# EAGLE design charging_circuit (EAGLE 7.0.0)
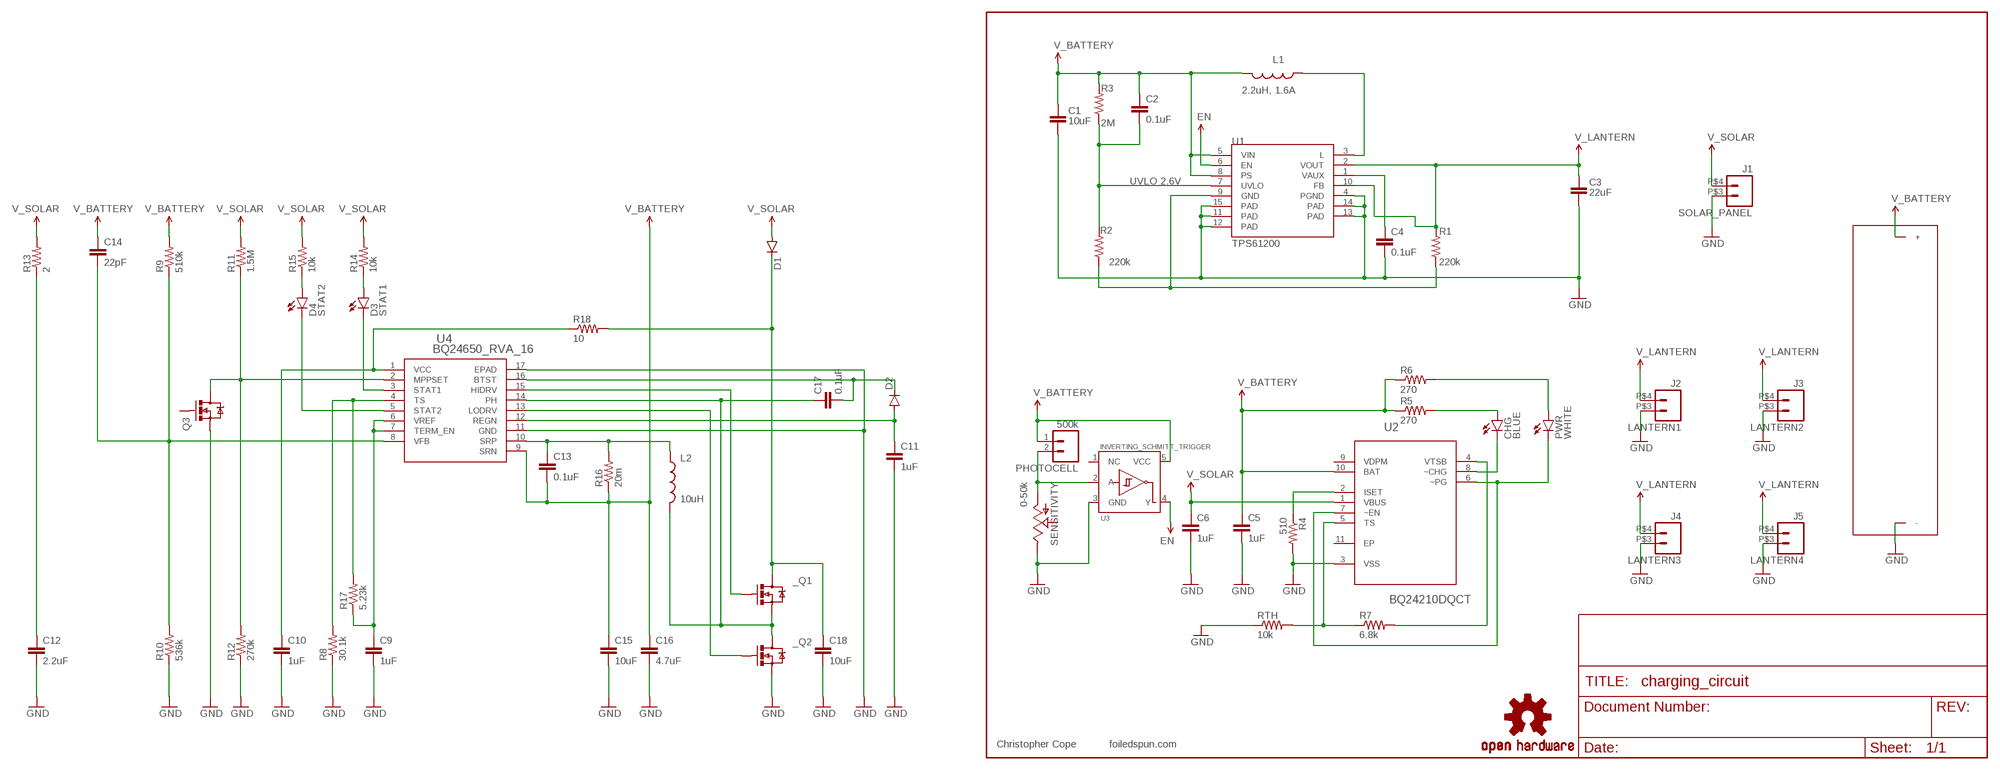
[diagram p0: schematic, sheet 1]

## Parts
_  MOSFET-DUAL_NCHANNEL  [POWERPAK_SO-8]
C1  10uF  CAP1206  [1206]
C2  0.1uF  CAP0402-CAP  [0402-CAP]
C3  22uF  CAP0805  [0805]
C4  0.1uF  CAP0402-CAP  [0402-CAP]
C5  1uF  1UF-25V-10%(0805)  [0805]
C6  1uF  1UF-25V-10%(0805)  [0805]
C9  1uF  CAP0402-CAP  [0402-CAP]
C10  1uF  CAP0402-CAP  [0402-CAP]
C11  1uF  CAP0402-CAP  [0402-CAP]
C12  2.2uF  CAP0402-CAP  [0402-CAP]
C13  0.1uF  CAP0805  [0805]
C14  22pF  CAP0603-CAP  [0603-CAP]
C15  10uF  CAP1210  [1210]
C16  4.7uF  CAP1210  [1210]
C17  0.1uF  CAP0805  [0805]
C18  10uF  CAP1210  [1210]
CHG  BLUE  LED0603  [LED-0603]
D1  DIODEPDS1040  [POWERDI-5]
D2  DIODESOT23  [SOT23-3]
D3  STAT1  LED-GREEN0603  [LED-0603]
D4  STAT2  LED-GREEN0603  [LED-0603]
L1  2.2uH, 1.6A  INDUCTOR1210  [1210]
L2  10uH  INDUCTORIHLP-2525CZ-01  [IHLP-2525CZ-01]
LANTERN1  J2  MICRO_MATE-N-LOCK  [2-1445100-2]
LANTERN2  J3  MICRO_MATE-N-LOCK  [2-1445100-2]
LANTERN3  J4  MICRO_MATE-N-LOCK  [2-1445100-2]
LANTERN4  J5  MICRO_MATE-N-LOCK  [2-1445100-2]
LOGO2  OSHW-LOGOL  [OSHW-LOGO-L]
PHOTOCELL  500k  M021X02_SMD  [1X02_SMD]
PWR  WHITE  LED0603  [LED-0603]
Q3  MOSFET-NCHANNEL  [SOT23-3]
R1  220k  RESISTOR0402-RES  [0402-RES]
R2  220k  RESISTOR0402-RES  [0402-RES]
R3  2M  RESISTOR0402-RES  [0402-RES]
R4  510  RESISTOR0402-RES  [0402-RES]
R5  270  RESISTOR0402-RES  [0402-RES]
R6  270  RESISTOR0402-RES  [0402-RES]
R7  6.8k  RESISTOR0402-RES  [0402-RES]
R8  30.1k  RESISTOR0402-RES  [0402-RES]
R9  510k  RESISTOR0402-RES  [0402-RES]
R10  536k  RESISTOR0402-RES  [0402-RES]
R11  1.5M  RESISTOR0402-RES  [0402-RES]
R12  270k  RESISTOR0402-RES  [0402-RES]
R13  2  RESISTOR0402-RES  [0402-RES]
R14  10k  RESISTOR0402-RES  [0402-RES]
R15  10k  RESISTOR0402-RES  [0402-RES]
R16  20m  RESISTOR1206  [1206]
R17  5.23k  RESISTOR0402-RES  [0402-RES]
R18  10  RESISTOR1206  [1206]
RTH  10k  RESISTOR0402-RES  [0402-RES]
SENSITIVITY  0-50k  POTTRIM_POT-SMD  [TRIM_POT-SMD]
SOLAR_PANEL  J1  MICRO_MATE-N-LOCK  [2-1445100-2]
U1  TPS61200  [QFN-10_PAD]
U2  BQ24210DQCT  [SON50P200X300X80-11N]
U3  INVERTING_SCHMITT_TRIGGER  [SC-70-5(DCK)]
U4  BQ24650_RVA_16  [RVA16_2P14X2P14]
U$1  18650-HOLDER  [18650]

## Nets
EN: U1.6(EN) U3.4(Y)
GND: _.P$3$S2(Q2:S) C1.2 C3.2 C4.2 C5.2 C6.2 C9.2 C10.2 C11.2 C12.2 C15.2 C16.2 C18.2 LANTERN1.P$3 LANTERN2.P$3 LANTERN3.P$3 LANTERN4.P$3 Q3.2(S) R4.2 R8.1 R10.1 R12.1 RTH.1 SENSITIVITY.P$3(E) SOLAR_PANEL.P$3 U1.4(PGND) U1.11(PAD) U1.12(PAD) U1.13(PAD) U1.14(PAD) U1.15(PAD) U2.3(VSS) U3.3(GND) U4.11(GND) U4.17(EPAD) U$1.-
GND1: R1.1 R2.1 U1.9(GND)
N$1: C4.1 U1.1(VAUX)
N$2: L1.1 U1.3(L)
N$3: CHG.C U2.8(~CHG)
N$4: PWR.C U2.6(~PG) U2.7(~EN)
N$5: CHG.A R5.2
N$6: PWR.A R6.2
N$7: PHOTOCELL.2 SENSITIVITY.P$1(A) U3.2(A)
N$8: R4.1 U2.2(ISET)
N$9: R7.2 U2.4(VTSB)
N$11: R7.1 RTH.2 U2.5(TS)
N$14: C10.1 R18.1 U4.1(VCC)
N$15: C14.2 R9.1 R10.2 U4.8(VFB)
N$18: C11.1 D2.1(A) U4.12(REGN)
N$19: Q3.3(D) R11.1 R12.2 U4.2(MPPSET)
N$22: C12.1 R13.1
N$23: D3.C U4.3(STAT1)
N$26: D4.C U4.5(STAT2)
N$27: D4.A R15.1
N$30: D3.A R14.1
N$31: R8.2 R17.2 U4.4(TS)
N$32: C17.2 D2.3(C) U4.16(BTST)
N$33: _.P$1$S1(Q1:S) _.P$5$D2(Q2:D) _.P$6$D2(Q2:D) _.P$D2(Q2:D) C17.1 L2.P$2 U4.14(PH)
N$34: C9.1 R17.1 U4.6(VREF) U4.7(TERM_EN)
N$35: _.P$4$G2(Q2:G) U4.13(LODRV)
N$36: _.P$2$G1(Q1:G) U4.15(HIDRV)
N$37: _.P$7$D1(Q1:D) _.P$8$D1(Q1:D) _.P$D1(Q1:D) C18.1 D1.P$3(C) R18.2
N$38: C13.1 L2.P$1 R16.2 U4.10(SRP)
UVLO: C2.2 R2.2 R3.1 U1.7(UVLO)
V_BATTERY: C1.1 C2.1 C5.1 C13.2 C14.1 C15.1 C16.1 L1.2 PHOTOCELL.1 R3.2 R5.1 R6.1 R9.2 R16.1 U1.5(VIN) U1.8(PS) U2.10(BAT) U3.5(VCC) U4.9(SRN) U$1.+
V_LANTERN: C3.1 LANTERN1.P$4 LANTERN2.P$4 LANTERN3.P$4 LANTERN4.P$4 R1.2 U1.2(VOUT) U1.10(FB)
V_SOLAR: C6.1 D1.P$1(A) D1.P$2(A) R11.2 R13.2 R14.2 R15.2 SOLAR_PANEL.P$4 U2.1(VBUS)
Unconnected: Q3.1(G) SENSITIVITY.P$2(S) U2.9(VDPM) U2.11(EP) U3.1(NC)

## Notes on the sheet
- UVLO 2.6V
- Christopher Cope | foiledspun.com

## Library data of the parts
_ = EAGLE_Libraries:MOSFET-DUAL_NCHANNEL
C1 C3 = CH_passive:CAP: Capacitor Standard 0603 ceramic capacitor, and 0.1" leaded capacitor.
C2 C4 C9-C12 = SparkFun:CAP: Capacitor Standard 0603 ceramic capacitor, and 0.1" leaded capacitor.
C5 C6 = SparkFun-Capacitors:1UF-25V-10%(0805): CAP-08064; PROD_ID: CAP-08064
C13-C18 = SparkFun-Passives:CAP: Capacitor Standard 0603 ceramic capacitor, and 0.1" leaded capacitor.
CHG PWR = SparkFun-LED:LED: LEDs Standard schematic elements and footprints for 5mm, 3mm, 1206, and 0603 sized LEDs. 5mm - Spark Fun Electronics SKU : COM-00529 (and others)
D1 = EAGLE_Libraries:DIODE: Diode These are standard reverse protection diodes and small signal diodes. SMA package can handle up to about 1A. SOD-323 can handle about 200mA. What the SOD-323 package when ordering, there are some mfgs out there that are 5-pin packages.
D2 = SparkFun-DiscreteSemi:DIODE: Diode These are standard reverse protection diodes and small signal diodes. SMA package can handle up to about 1A. SOD-323 can handle about 200mA. What the SOD-323 package when ordering, there are some mfgs out there that are 5-pin packages.
D3 D4 = SparkFun-LED:LED-GREEN: Various green LEDs Green LEDs used in SFE Production 0603- DIO-00821 LARGE- DIO-00862 LILYPAD- DIO-09910; PROD_ID: DIO-00821; VALUE: GREEN
L1 = CRC:INDUCTOR: Inductors
L2 = EAGLE_Libraries:INDUCTOR: Inductors
LANTERN1-LANTERN4 SOLAR_PANEL = CRC:MICRO_MATE-N-LOCK
LOGO2 = SparkFun-Aesthetics:OSHW-LOGO: Open Source Hardware Logo This logo indicates the piece of hardware it is found on incorporates a OSHW license and/or adheres to the definition of open source hardware found here: http://freedomdefined.org/OSHW
PHOTOCELL = CRC:M02: Header 2 Standard 2-pin 0.1" header. Use with straight break away headers (SKU : PRT-00116), right angle break away headers (PRT-00553), swiss pins (PRT-00743), machine pins (PRT-00117), and female headers (PRT-00115). Molex polarized connector foot print use with SKU : PRT-08233 with associated crimp pins and housings.
Q3 = EAGLE_Libraries:MOSFET-NCHANNEL: Generic NMOSFET 2N7002-7 - 2N7002-FDICT-ND <http://www.sparkfun.com/products/10349> (SOT-23-3 -60V ) (1.Gate 2.Source 3.Drain); PROD_ID: 2N7002-FDICT-ND
R1-R3 R9-R13 = SparkFun:RESISTOR: Resistor Basic schematic elements and footprints for 0603, 1206, and PTH resistors.
R4-R7 RTH = SparkFun-Resistors:RESISTOR: Resistor Basic schematic elements and footprints for 0603, 1206, and PTH resistors.
R8 R14-R18 = SparkFun-Passives:RESISTOR: Resistor Basic schematic elements and footprints for 0603, 1206, and PTH resistors.
SENSITIVITY = CRC:POT
U1 = SparkFun:TPS61200: DC to DC Booster
U2 = CRC:BQ24210DQCT: Single Cell Li-Ion Battery Solar Charger; MPN: BQ24210DQCT; OC_FARNELL: 1903633; OC_NEWARK: 56T0491; PACKAGE: SON-10; SUPPLIER: TEXAS INSTRUMENTS
U3 = CRC:INVERTING_SCHMITT_TRIGGER: Inverting Schmitt Trigger Used in External Clock Sources. Digikey P/N 296-11608-1-ND
U4 = CRC:BQ24650_RVA_16; DATASHEETURL: http://www.ti.com/lit/gpn/BQ24650; DESCRIPTION: High Efficiency Synchronous Switch-Mode Charger Controller  Solar Battery Charger; FAMILY_NAME: BATTERY CHARGE MANAGEMENT; GENERIC_PART_NUMBER: BQ24650; INDUSTRY_STD_PKG_TYPE: VQFN; MANUFACTURER: Texas Instruments; PACKAGE_DESIGNATOR: RVA; PIN_COUNT: 16
U$1 = CRC:18650-HOLDER

## Board
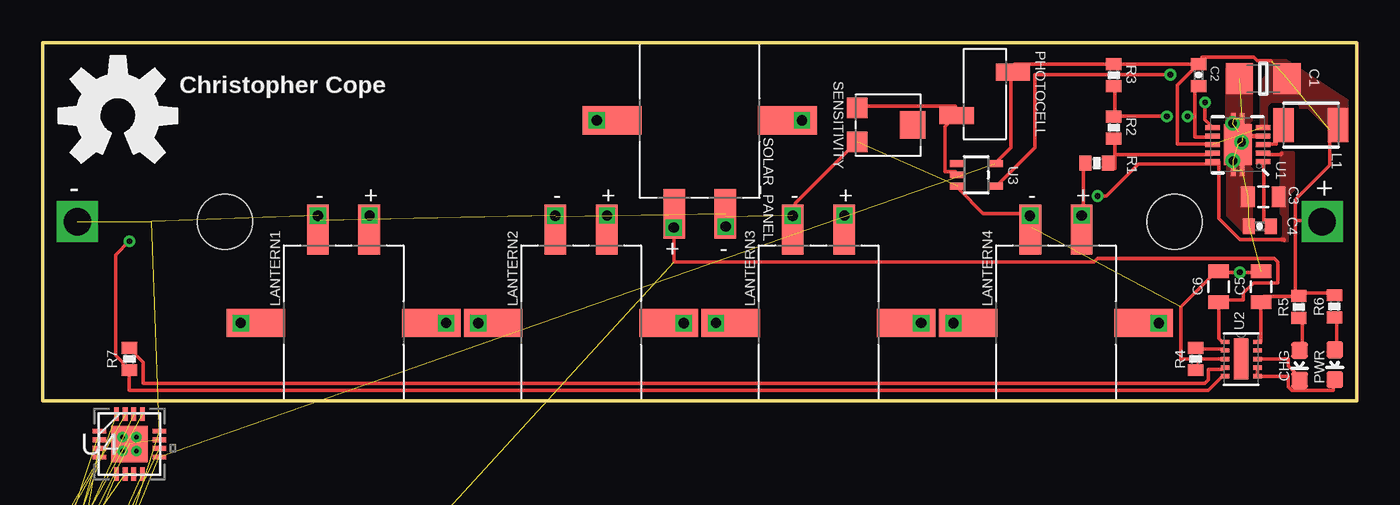
[diagram p1: board, top side]
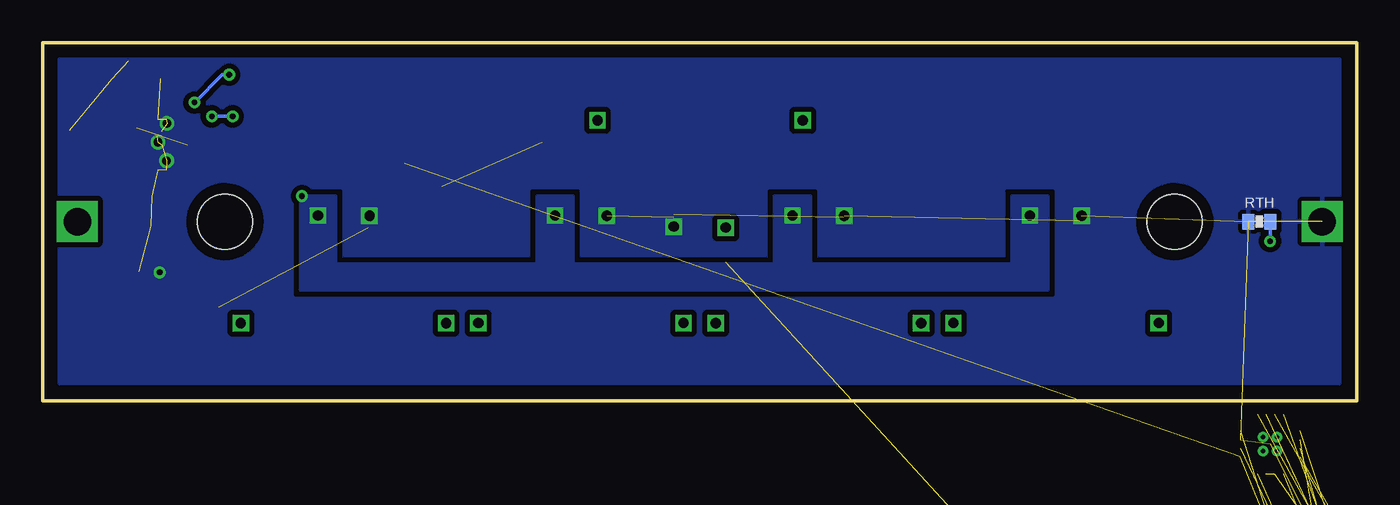
[diagram p2: board, bottom side, seen from below]

Size 76.96 x 20.98 mm. Coordinates in mm from the lower left corner, seen from the top.
Outline: 0,0 76.96,0 76.96,20.98 0,20.98 0,0
Copper layers (1*16): Top 0.0356mm / dielectric 1.5011mm / Bottom 0.0356mm
Design rules "LaenPCBOrder *": minimum track width 8mil, minimum drill 13mil, track to track 6mil, track to pad 6mil, pad to pad 6mil, via to via 6mil, smd to smd 6mil, copper to edge 15mil, drill to drill 6mil, minimum pad ring 7mil, minimum via ring 7mil, stop-mask expansion 4mil, vias tented up to drill 20mil, thermal gap 10mil

### Footprints (pad centres in the part's own frame; a part is rotated, then mirrored left to right if it is on the bottom)
POWERPAK_SO-8 = smd 1.27 x 0.61: P$1$S1 -2.667,1.905; P$2$G1 -2.667,0.635; P$3$S2 -2.667,-0.635; P$4$G2 -2.667,-1.905 | smd 1.016 x 0.61: P$5$D2 2.794,-1.905; P$6$D2 2.794,-0.635; P$7$D1 2.794,0.635; P$8$D1 2.794,1.905 | smd 3.81 x 1.651: P$D1 0.686,1.13; P$D2 0.686,-1.13
1206 = smd 1.6 x 1.8: 1 -1.4,0; 2 1.4,0
0402-CAP = smd 0.7 x 0.9: 1 -0.65,0; 2 0.65,0
0805 = smd 0.8 x 1.2: 1 -0.9,0; 2 0.9,0
0603-CAP = smd 1.1 x 1: 1 -0.85,0; 2 0.85,0
1210 = smd 1.2 x 2: 1 -1.6,0; 2 1.6,0
LED-0603 = smd 1 x 1: A 0,-0.877; C 0,0.877
POWERDI-5 = smd 1.39 x 1.4: P$1 -0.92,-2.856; P$2 0.92,-2.856 | smd 3.36 x 4.86: P$3 0,1.126
SOT23-3 = smd 0.8 x 0.9: 1 -0.95,-1; 2 0.95,-1; 3 0,1.1
IHLP-2525CZ-01 = smd 1.829 x 3.429: P$1 -2.769,0; P$2 2.769,0
2-1445100-2 = smd 3.43 x 1.65: P$1 5.135,0; P$2 -5.135,0 | smd 1.27 x 2.92: P$3 -1.5,5.48; P$4 1.5,5.48
1X02_SMD = smd 1 x 2: 1 1.27,-1.65; 2 -1.27,1.65
0402-RES = smd 0.7 x 0.9: 1 -0.65,0; 2 0.65,0
TRIM_POT-SMD = smd 1.2 x 1.2: P$1 -1,-1.8; P$3 1,-1.8 | smd 1.6 x 1.5: P$2 0,1.45
QFN-10_PAD = smd 0.297 x 0.85: 1 -1,-1.475; 2 -0.5,-1.475; 3 0,-1.475; 4 0.5,-1.475; 5 1,-1.475; 6 1,1.475; 7 0.5,1.475; 8 0,1.475; 9 -0.5,1.475; 10 -1,1.475 | smd 0.7 x 0.28: 11 -1.5,0.25; 12 -1.5,-0.25; 13 1.5,0.25; 14 1.5,-0.25 | smd 2.4 x 1.65: 15 0,0
SON50P200X300X80-11N = smd 0.5 x 0.25: 1 -0.95,1; 2 -0.95,0.5; 3 -0.95,0; 4 -0.95,-0.5; 5 -0.95,-1; 6 0.95,-1; 7 0.95,-0.5; 8 0.95,0; 9 0.95,0.5; 10 0.95,1 | smd 0.84 x 2.4: 11 0,0
SC-70-5(DCK) = smd 0.4 x 0.9: 1 -0.65,-1.1; 2 0,-1.1; 3 0.65,-1.1; 4 0.65,1.1; 5 -0.65,1.1
RVA16_2P14X2P14 = smd 0.787 x 0.279: 1 -1.753,0.762; 2 -1.753,0.254; 3 -1.753,-0.254; 4 -1.753,-0.762; 9 1.753,-0.762; 10 1.753,-0.254; 11 1.753,0.254; 12 1.753,0.762 | smd 0.279 x 0.787: 5 -0.762,-1.753; 6 -0.254,-1.753; 7 0.254,-1.753; 8 0.762,-1.753; 13 0.762,1.753; 14 0.254,1.753; 15 -0.254,1.753; 16 -0.762,1.753 | smd 2.134 x 2.134: 17 0,0 | drill 0.254: V 0.406,0.406; V_2 -0.406,0.406; V_3 -0.406,-0.406; V_4 0.406,-0.406
18650 = drill 1.6 square: + 36.45,0; - -36.45,0 | hole 3.2: -27.81,0; 27.81,0

### Placement (x,y rotation side)
_  -25.4,-60.2 0 top  (outside the outline)
C1  71.48,18.86 180 top
C2  67.69,19.07 270 top
C3  71.48,11.96 180 top
C4  71.28,10.23 180 top
C5  71.35,6.68 90 top
C6  68.88,6.68 90 top
C9  -1.27,-13.97 0 top  (outside the outline)
C10  -1.27,-17.78 0 top  (outside the outline)
C11  -1.27,-29.21 0 top  (outside the outline)
C12  -1.27,-44.45 0 top  (outside the outline)
C13  -14.3,-49.4 0 top  (outside the outline)
C14  -14.3,-52.7 0 top  (outside the outline)
C15  -13.5,-59.6 0 top  (outside the outline)
C16  -13.5,-62.5 0 top  (outside the outline)
C17  -20.4,-61.9 0 top  (outside the outline)
C18  -26.5,-65.4 0 top  (outside the outline)
CHG  73.61,2.07 180 top
D1  -39.4,-68.3 0 top  (outside the outline)
D2  -17.4,-62.3 0 top  (outside the outline)
D3  -8.7,-44.5 0 top  (outside the outline)
D4  -11.6,-44.5 0 top  (outside the outline)
L1  74.27,16.15 0 top
L2  -32.6,-62.4 0 top  (outside the outline)
LANTERN1  17.62,4.55 0 top
LANTERN2  31.53,4.55 0 top
LANTERN3  45.43,4.55 0 top
LANTERN4  59.34,4.55 0 top
LOGO2  4.4,16.7 0 top
PHOTOCELL  55.17,17.98 90 top
PWR  75.67,2.11 180 top
Q3  -5.6,-44.5 0 top  (outside the outline)
R1  61.73,13.93 180 top
R2  62.73,16 90 top
R3  62.73,19.07 90 top
R4  67.52,2.44 270 top
R5  73.56,5.5 270 top
R6  75.64,5.53 270 top
R7  5.08,2.44 90 top
R8  -34.7,-68.1 0 top  (outside the outline)
R9  -1.27,-21.59 0 top  (outside the outline)
R10  -1.27,-25.4 0 top  (outside the outline)
R11  -1.27,-33.02 0 top  (outside the outline)
R12  -1.27,-36.83 0 top  (outside the outline)
R13  -1.27,-40.64 0 top  (outside the outline)
R14  -11.2,-47.4 0 top  (outside the outline)
R15  -11.2,-49.7 0 top  (outside the outline)
R16  -13.3,-56.1 0 top  (outside the outline)
R17  -34.7,-70.4 0 top  (outside the outline)
R18  -40,-73.8 0 top  (outside the outline)
RTH  5.71,10.49 0 bottom
SENSITIVITY  49.51,16.15 270 top
SOLAR_PANEL  38.48,16.43 180 top
U1  69.98,15 90 top
U2  70.19,2.44 0 top
U3  54.67,13.23 270 top
U4  5.08,-2.54 0 top
U$1  38.48,10.49 0 top

### Tracks (layer width: path | path; a pad name or v marks a point on that pad's centre or on a via)
EN  (via drill 0.33)
  Top 0.203: v68.07,17.48 68.07,16.46 68.48,16.05 U1.6 | v66.04,19.1 58.12,19.1 58.12,14.83 55.88,12.6 U3.4
  Bottom 0.203: v68.07,17.48 66.45,19.1 v66.04,19.1
GND  (via drill 0.33, 0.51, 0.6)  (33 unrouted)
  Top 0.203: 67.67,2.44 67.67,1.83 R4.2 | C5.2 71.32,7.52 v70.1,7.52 68.89,7.52 C6.2 68.68,7.52 66.65,5.49 66.65,2.44 67.67,2.44 | 44.09,10.97 44.09,11.58 47.55,15.04 SENSITIVITY.P$3 | 67.67,2.44 69.09,2.44 U2.3 | U3.3 53.65,12.39 55.07,10.97 57.71,10.97 v57.82,10.84 57.91,10.77 57.91,10.16 LANTERN4.P$3 | LANTERN2.P$3 30.07,10.16 30.07,10.77 v30.02,10.84 | SOLAR_PANEL.P$3 40.03,10.77 40.03,10.36 v40,10.2 | 44.09,10.97 LANTERN3.P$3 | 44.09,10.97 v43.92,10.84
  Top 0.254: U1.4 70.29,15.5 70.03,15.77
  Top 0.813: LANTERN1.P$3 16.26,10.57 v16.12,10.84
  other vias: 70.21,15.16 69.7,14.06 69.68,16.25
  pour Top (isolate 0.305, no thermals): 69.35,9.39 69.35,19.45 70.79,19.45 70.79,9.41
  pour Bottom (isolate 0.305, rank 2): 1,20 1,1 76,1 76,20
GND1
  Top 0.203: 62.79,14.43 68.48,14.43 U1.9 | 62.79,14.43 62.79,15.24 R2.1 | 62.79,14.43 62.79,13.61 R1.1
N$1
  Top 0.203: U1.1 71.53,14.02 71.53,10.57 71.73,10.36 C4.1
N$2
  Top 0.203: U1.3 71.63,15.03 72.24,15.03 72.24,15.23 72.64,15.64 72.64,16.04 72.54,16.05 72.75,16.05 L1.1
N$3
  Top 0.203: U2.8 71.32,2.44 72.95,2.44 72.95,2.03 73.56,1.42 CHG.C
N$4
  Top 0.203: U2.7 71.12,1.83 71.12,1.42 U2.6 71.32,1.42 72.95,1.42 72.95,0.81 73.15,0.61 75.59,0.61 75.59,1.22 PWR.C
N$5
  Top 0.203: CHG.A 73.76,2.85 73.76,4.67 R5.2
N$6
  Top 0.203: PWR.A 75.79,3.05 75.79,4.88 R6.2
N$7
  Top 0.203: U3.2 53.44,13.41 52.83,13.41 52.83,16.05 53.44,16.66 PHOTOCELL.2 53.44,16.87 53.44,17.27 47.75,17.27 SENSITIVITY.P$1
N$8
  Top 0.203: U2.2 69.09,3.05 67.67,3.05 R4.1
N$9
  Top 0.203: U2.4 69.09,1.83 68.28,1.83 68.28,1.22 68.07,1.02 5.89,1.02 5.89,2.23 5.08,3.05 R7.2
N$11  (via drill 0.33)
  Top 0.203: U2.5 69.09,1.42 68.28,0.61 5.08,0.61 R7.1 5.08,1.83 4.27,2.64 4.27,8.53 v5.08,9.35
  Bottom 0.203: v5.08,9.35 5.08,10.36 RTH.2
N$12  (via drill 0.6)
  other vias: 11.6,4.55
N$13  (via drill 0.6)
  other vias: 23.62,4.55
N$14  (2 unrouted)
N$15  (3 unrouted)
N$16  (via drill 0.6)
  other vias: 25.52,4.54
N$17  (via drill 0.6)
  other vias: 37.54,4.54
N$18  (2 unrouted)
N$19  (3 unrouted)
N$20  (via drill 0.6)
  other vias: 39.43,4.55
N$21  (via drill 0.6)
  other vias: 51.45,4.55
N$22  (1 unrouted)
N$23  (1 unrouted)
N$24  (via drill 0.6)
  other vias: 53.34,4.54
N$25  (via drill 0.6)
  other vias: 65.36,4.54
N$26  (1 unrouted)
N$27  (1 unrouted)
N$28  (via drill 0.6)
  other vias: 44.47,16.43
N$29  (via drill 0.6)
  other vias: 32.45,16.43
N$30  (1 unrouted)
N$31  (2 unrouted)
N$32  (2 unrouted)
N$33  (6 unrouted)
N$34  (3 unrouted)
N$35  (1 unrouted)
N$36  (1 unrouted)
N$37  (5 unrouted)
N$38  (3 unrouted)
UVLO  (via drill 0.33)
  Top 0.203: 68.52,15.46 U1.7 68.48,15.44 67.46,15.44 67.46,16.66 | 62.79,16.66 62.79,18.29 R3.1 | 67.46,16.66 67.46,18.09 67.67,18.29 C2.2 | v65.84,16.66 62.79,16.66 | 67.46,16.66 v67.06,16.66 | 62.79,16.66 R2.2
  Bottom 0.203: v67.06,16.66 v65.84,16.66
V_BATTERY  (10 unrouted)
  Top 0.203: 67.67,19.71 66.45,18.49 66.45,15.04 68.48,15.04 U1.8 | 67.67,19.71 62.79,19.71 R3.2 62.59,19.71 56.9,19.71 56.9,19.3 PHOTOCELL.1 56.69,19.1 56.69,14.83 55.88,14.02 U3.5 | 67.67,19.71 C2.1 67.87,19.91 67.87,20.12 70.92,20.12 71.12,19.91 71.93,19.91 71.94,19.88 | R5.1 73.76,6.3 75.59,6.3 R6.1 | U2.10 71.32,3.45 71.32,5.69 C5.1 | R5.1 73.56,6.1 71.53,6.1 71.53,5.89 C5.1 | 71.32,5.89 C5.1 | 73.36,10.57 73.36,11.79 75.39,13.82 75.39,15.85 L1.2 | 73.36,10.57 73.36,6.5 73.56,6.3 R5.1 | 73.36,10.57 74.78,10.57 U$1.+
  pour Top (isolate 0.305, no thermals): 76.65,15.97 76.65,17.37 72.8,19.88 71.94,19.88 71.94,19.32 71.4,18.64 71.4,16.12 71.35,15.99 71.86,15.99 71.86,16.25 72.83,17.24 74.15,17.24 75.42,15.97
V_LANTERN  (via drill 0.33, 0.6)
  Top 0.203: LANTERN1.P$4 19.1,10.16 19.1,10.77 v19.15,10.85 | LANTERN2.P$4 33.12,10.16 33.12,10.77 v33.05,10.85 | LANTERN3.P$4 46.94,10.16 46.94,10.77 v46.95,10.85 | U1.2 71.73,14.43 72.54,14.43 72.57,14.49 | 68.88,13.87 68.88,14.02 U1.10 | 68.88,13.87 68.88,10.67 70.1,9.45 72.7,9.45 72.7,9.4 | 60.96,10.97 60.96,13.82 R1.2 | 60.96,10.97 LANTERN4.P$4 | 60.96,10.97 v60.85,10.85 | v61.77,11.99 62.28,11.99 64.16,13.87 68.88,13.87 | 68.89,12.6 68.88,13.87
  Top 0.305: C3.1 72.64,11.88 72.62,11.88
  pour Bottom (isolate 0.305): 61.85,12 59.8,12 59.8,8 48,8 48,12 45.9,12 45.9,8 34.1,8 34.1,12 32,12 32,8 20.2,8 20.2,12 18.1,12 18.1,6.5 61.85,6.5
  pour Top (isolate 0.305, no thermals): 72.57,9.41 72.57,14.49 73.21,14.49 73.21,9.41
V_SOLAR  (via drill 0.6)  (6 unrouted)
  Top 0.203: U2.1 69.09,3.45 68.89,3.66 68.89,5.69 C6.1 68.89,5.89 70.31,5.89 70.31,6.3 70.92,6.91 72.34,6.91 72.34,8.13 72.14,8.33 61.77,8.33 61.57,8.13 36.98,8.13 36.98,9.96 SOLAR_PANEL.P$4
  Top 0.406: v36.95,10.14 36.98,10.16 36.98,10.57 SOLAR_PANEL.P$4

### Text on the board
tNames: Christopher Cope | U1